# Altium schematic sheet Sheet1.SchDoc
size A; SheetNumber: 1; SheetTotal: 1
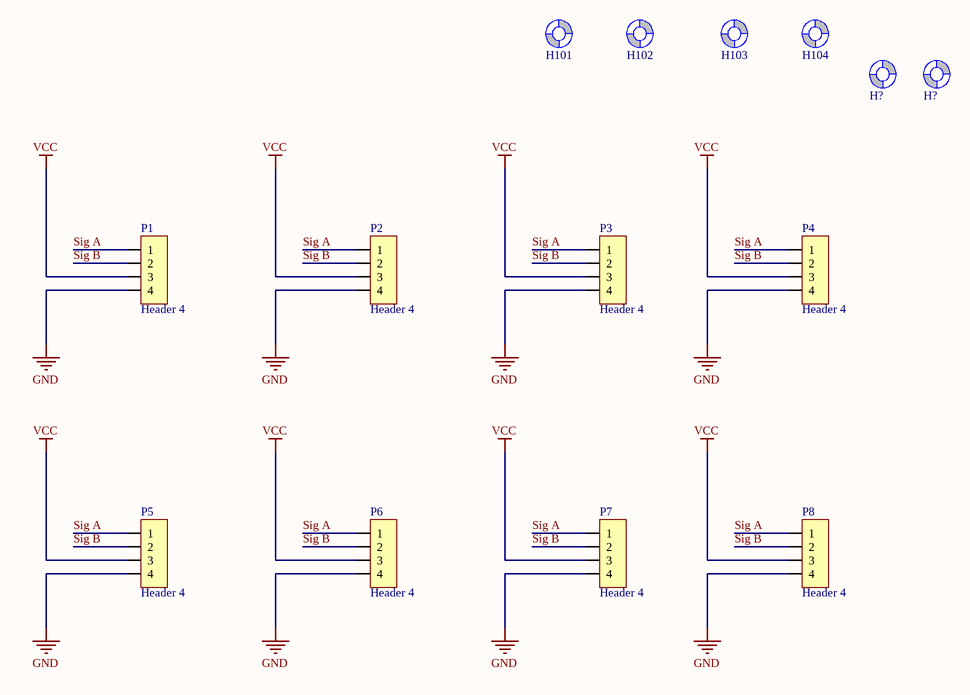
[diagram p0: Sheet1.SchDoc]

## Parts
(Parts that share a designator on the sheet are numbered #1, #2 ... from top to bottom, then left to right.)
H101  Screw Hole  [SCREW/2.8/5.0]  (value not drawn)  (no BOM)
H102  Screw Hole  [SCREW/2.8/5.0]  (value not drawn)  (no BOM)
H103  Screw Hole  [SCREW/2.8/5.0]  (value not drawn)  (no BOM)
H104  Screw Hole  [SCREW/2.8/5.0]  (value not drawn)  (no BOM)
H?#1  Screw Hole  [SCREW/2.8/5.0]  (value not drawn)  (no BOM)
H?#2  Screw Hole  [SCREW/2.8/5.0]  (value not drawn)  (no BOM)
P1  Header 4  [HDR/Terminal/4/RA]
P2  Header 4  [HDR/Terminal/4/RA]
P3  Header 4  [HDR/Terminal/4/RA]
P4  Header 4  [HDR/Terminal/4/RA]
P5  Header 4  [HDR/Terminal/4/RA]
P6  Header 4  [HDR/Terminal/4/RA]
P7  Header 4  [HDR/Terminal/4/RA]
P8  Header 4  [HDR/Terminal/4/RA]

## Nets
GND: P1.4 P2.4 P3.4 P4.4 P5.4 P6.4 P7.4 P8.4
VCC: P1.3 P2.3 P3.3 P4.3 P5.3 P6.3 P7.3 P8.3
Sig A: P1.1 P2.1 P3.1 P4.1 P5.1 P6.1 P7.1 P8.1
Sig B: P1.2 P2.2 P3.2 P4.2 P5.2 P6.2 P7.2 P8.2

Not connected (* = marked no-connect by the designer): H101 1(Screw); H102 1(Screw); H103 1(Screw); H104 1(Screw); H?#1 1(Screw); H?#2 1(Screw)

## Library data of the parts
P1-P8 = Header 4: Header, 4-Pin
H101-H104 H?#1 H?#2 = Screw Hole: TYPE: NO-BOM; UNIT PRICE: 0